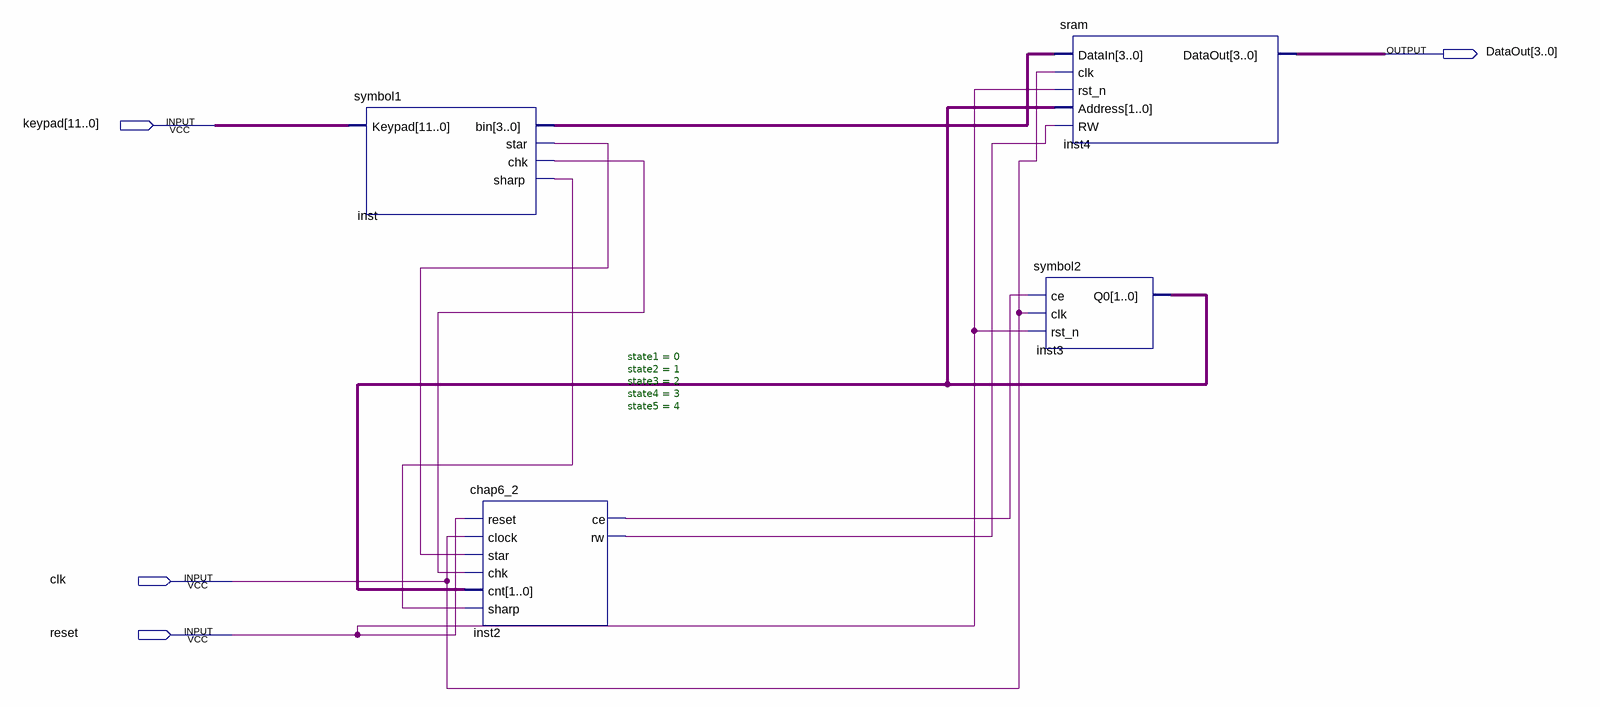
[diagram p0: schematic sheet]
// Quartus schematic chap6_chae.bdf as structural Verilog: 4 symbols, 4 pins
module chap6_chae (
  input  [11:0] keypad,
  input  clk,
  input  reset,
  output [3:0] DataOut
);

  wire inst2_ce, inst2_rw, inst_chk, inst_sharp, inst_star;
  wire [1:0] inst3_q0;
  wire [3:0] inst_bin;

  symbol1 inst (.Keypad(keypad), .bin(inst_bin), .star(inst_star), .chk(inst_chk), .sharp(inst_sharp));
  chap6_2 #(.state1(0), .state2(1), .state3(2), .state4(3), .state5(4)) inst2 (
    .reset(reset), .clock(clk), .star(inst_star), .chk(inst_chk), .cnt(inst3_q0), .sharp(inst_sharp),
    .ce(inst2_ce), .rw(inst2_rw));
  symbol2 inst3 (.ce(inst2_ce), .clk(clk), .rst_n(reset), .Q0(inst3_q0));
  sram inst4 (.DataIn(inst_bin), .clk(clk), .rst_n(reset), .Address(inst3_q0), .RW(inst2_rw), .DataOut(DataOut));
endmodule
